# Altium schematic sheet ngh-lcd.SchDoc
size A4
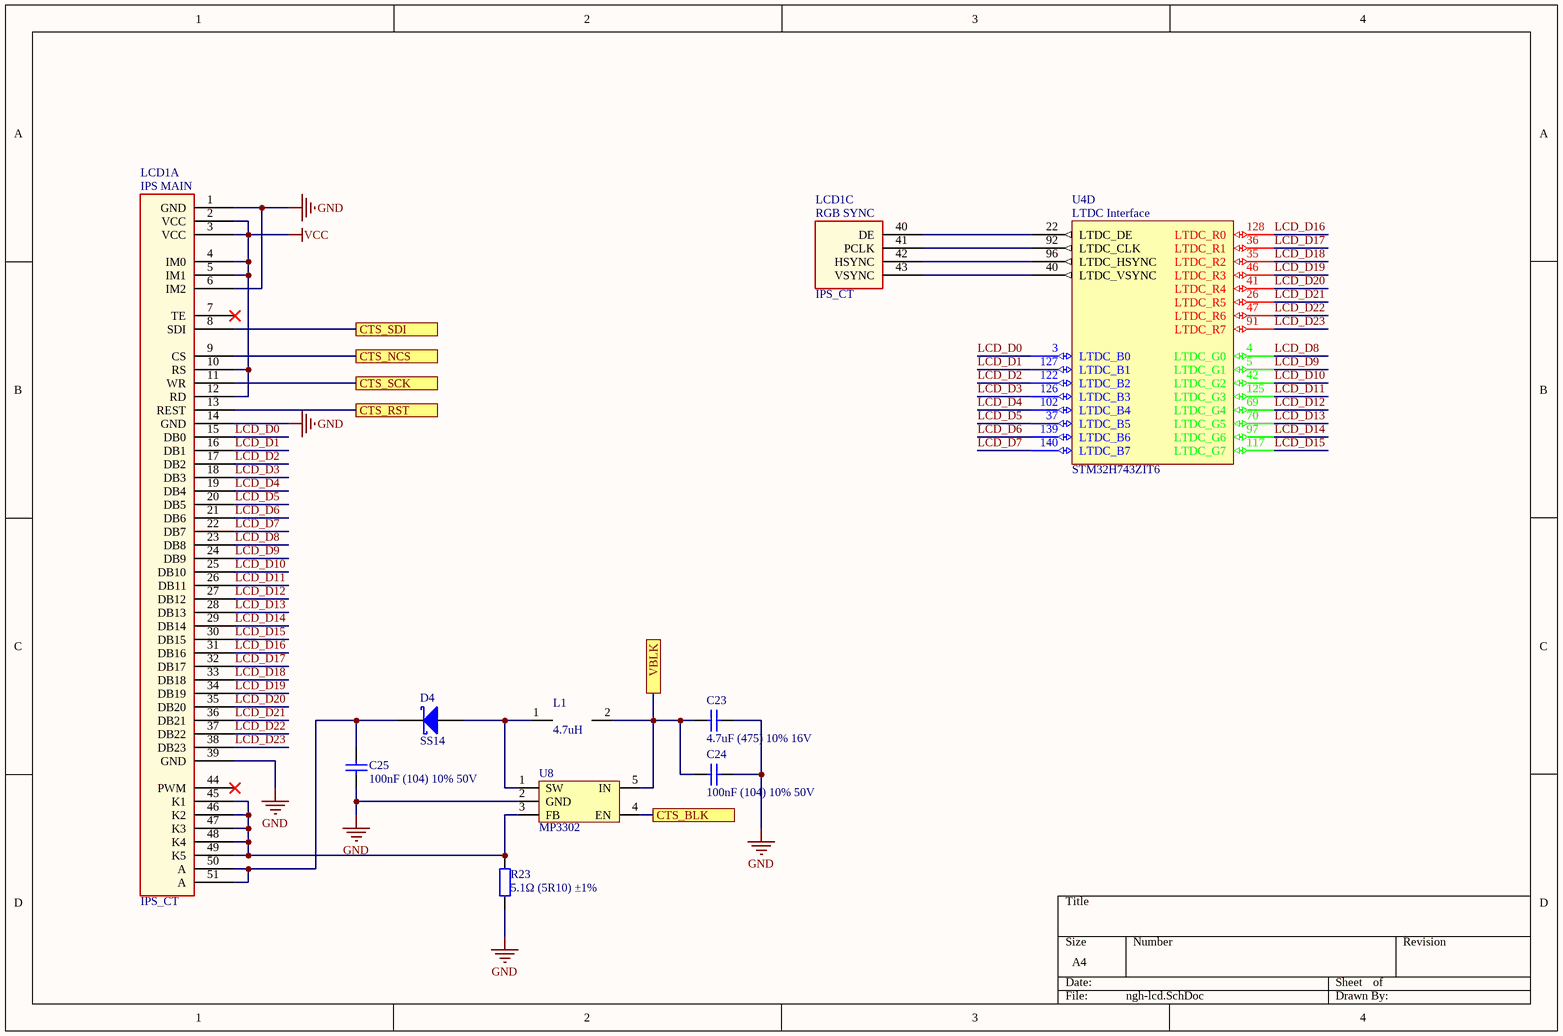
[diagram p0: ngh-lcd.SchDoc]

## Parts
C23  4.7uF (475) 10% 16V  [0603_C]
C24  100nF (104) 10% 50V  [0603_C]
C25  100nF (104) 10% 50V  [0603_C]
D4  SS14  [SOD123]
L1  4.7uH  [L453226]
LCD1  IPS_CT  [IPS_CT]  (parts A,C of 3)
R23  5.1Ω (5R10) ±1%  [0603_R]
U4  STM32H743ZIT6  [LQFP-144_20x20]  (part D of 6)
U8  MP3302  [SOT23-5]

## Ports
CTS_BLK, CTS_NCS, CTS_RST, CTS_SCK, CTS_SDI, VBLK

## Nets
GND: C23.2 C24.2 C25.1 LCD1.1(GND) LCD1.6(IM2) LCD1.14(GND) LCD1.39(GND) R23.1 U8.2(GND)
VCC: LCD1.2(VCC) LCD1.3(VCC) LCD1.4(IM0) LCD1.5(IM1) LCD1.10(RS) LCD1.12(RD)
CTS_BLK: U8.4(EN) ; port CTS_BLK
CTS_NCS: LCD1.9(CS) ; port CTS_NCS
CTS_RST: LCD1.13(REST) ; port CTS_RST
CTS_SCK: LCD1.11(WR) ; port CTS_SCK
CTS_SDI: LCD1.8(SDI) ; port CTS_SDI
LCD_D0: LCD1.15(DB0) U4.3(LTDC_B0)
LCD_D1: LCD1.16(DB1) U4.127(LTDC_B1)
LCD_D2: LCD1.17(DB2) U4.122(LTDC_B2)
LCD_D3: LCD1.18(DB3) U4.126(LTDC_B3)
LCD_D4: LCD1.19(DB4) U4.102(LTDC_B4)
LCD_D5: LCD1.20(DB5) U4.37(LTDC_B5)
LCD_D6: LCD1.21(DB6) U4.139(LTDC_B6)
LCD_D7: LCD1.22(DB7) U4.140(LTDC_B7)
LCD_D8: LCD1.23(DB8) U4.4(LTDC_G0)
LCD_D9: LCD1.24(DB9) U4.5(LTDC_G1)
LCD_D10: LCD1.25(DB10) U4.42(LTDC_G2)
LCD_D11: LCD1.26(DB11) U4.125(LTDC_G3)
LCD_D12: LCD1.27(DB12) U4.69(LTDC_G4)
LCD_D13: LCD1.28(DB13) U4.70(LTDC_G5)
LCD_D14: LCD1.29(DB14) U4.97(LTDC_G6)
LCD_D15: LCD1.30(DB15) U4.117(LTDC_G7)
LCD_D16: LCD1.31(DB16) U4.128(LTDC_R0)
LCD_D17: LCD1.32(DB17) U4.36(LTDC_R1)
LCD_D18: LCD1.33(DB18) U4.35(LTDC_R2)
LCD_D19: LCD1.34(DB19) U4.46(LTDC_R3)
LCD_D20: LCD1.35(DB20) U4.41(LTDC_R4)
LCD_D21: LCD1.36(DB21) U4.26(LTDC_R5)
LCD_D22: LCD1.37(DB22) U4.47(LTDC_R6)
LCD_D23: LCD1.38(DB23) U4.91(LTDC_R7)
VBLK: C23.1 C24.1 L1.2 U8.5(IN) ; port VBLK
NetC25_2: C25.2 D4.2(K) LCD1.50(A) LCD1.51(A)
NetD4_1: D4.1(A) L1.1 U8.1(SW)
NetLCD1_40: LCD1.40(DE) U4.22(LTDC_DE)
NetLCD1_41: LCD1.41(PCLK) U4.92(LTDC_CLK)
NetLCD1_42: LCD1.42(HSYNC) U4.96(LTDC_HSYNC)
NetLCD1_43: LCD1.43(VSYNC) U4.40(LTDC_VSYNC)
NetLCD1_45: LCD1.45(K1) LCD1.46(K2) LCD1.47(K3) LCD1.48(K4) LCD1.49(K5) R23.2 U8.3(FB)

Not connected (* = marked no-connect by the designer): LCD1 7(TE)* 44(PWM)*

## Notes on the sheet
- (in symbol IPS_CT, part A) IPS MAIN
- (in symbol IPS_CT, part C) RGB SYNC
- (in symbol STM32H743ZIT6, part D) LTDC Interface

## Library data of the parts
C23 = 0603 4.7uF (475) 10% 16V: 贴片电容; ComponentLink1Description: 供应商链接; ComponentLink1URL: http://www.szlcsc.com/product/details_20375.html; Package: 0603; Supplier: LC; SuppliersPartNumber: C19666
C24 C25 = 0603 100nF (104) 10% 50V: 贴片电容; ComponentLink1Description: 供应商链接; ComponentLink1URL: http://www.szlcsc.com/product/details_15331.html; Package: 0603; Supplier: LC; SuppliersPartNumber: C14663
R23 = 0603 5.1Ω (5R10) 1%: 贴片电阻; ComponentLink1Description: 供应商链接; ComponentLink1URL: http://www.szlcsc.com/product/details_25940.html; Package: 0603; Supplier: LC; SuppliersPartNumber: C25197
D4 = SS14: Published: 8-Jun-2000; LatestRevisionDate: 17-Jul-2002; LatestRevisionNote: Re-released for DXP Platform.; PackageReference: SMB; Publisher: Altium Limited; PackageDescription: DO-214-AA/SMB; 2 C-Bend Leads; Body 5.3 x 3.6 mm, inc. leads (LxW); Code_JEDEC: DO-214-AA